# EAGLE design microsd-switch (EAGLE 6.5.0)
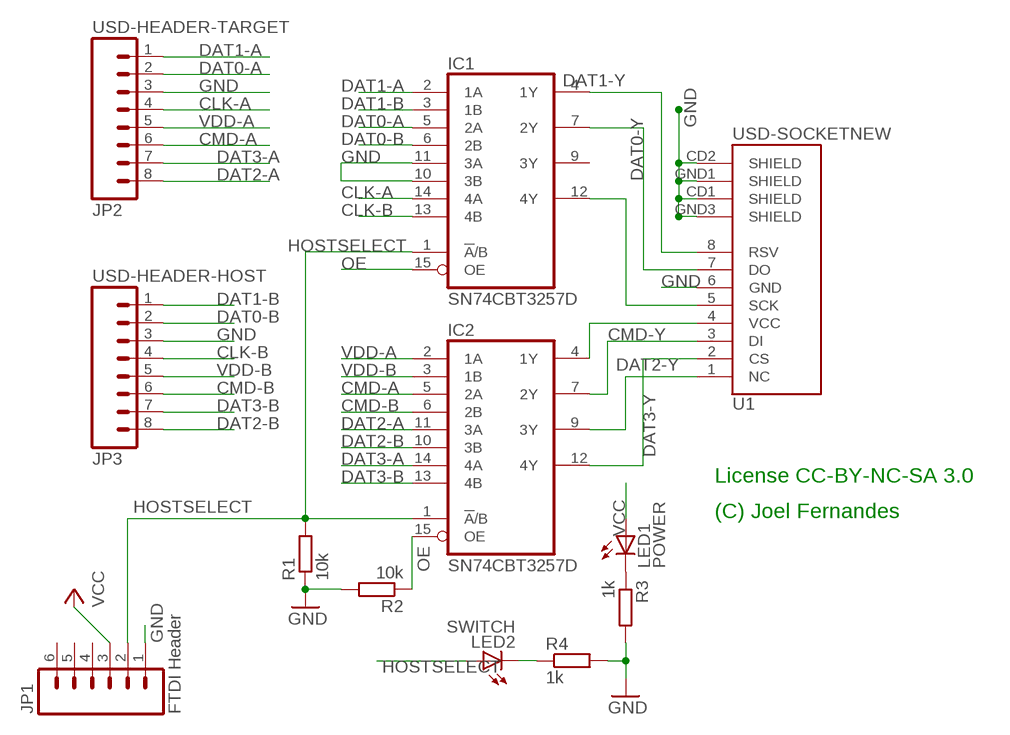
[diagram p0: schematic, sheet 1]

## Parts
IC1  SN74CBT3257D  [SO16]
IC2  SN74CBT3257D  [SO16]
JP1  FTDI Header  M06LOCK  [1X06_LOCK]
JP2  USD-HEADER-TARGET  M08LOCK  [1X08_LOCK]
JP3  USD-HEADER-HOST  M08LOCK  [1X08_LOCK]
LED1  POWER  LEDCHIP-LED0805  [CHIP-LED0805]
LED2  SWITCH  LEDCHIP-LED0805  [CHIP-LED0805]
R1  10k  R-EU_R1206  [R1206]
R2  10k  R-EU_R1206  [R1206]
R3  1k  R-EU_R1206  [R1206]
R4  1k  R-EU_R1206  [R1206]
U1  USD-SOCKETNEW  [MICRO-SD-SOCKET-PP]

## Nets
CLK-A: IC1.14(4A) JP2.4
CLK-B: IC1.13(4B) JP3.4
CLK-Y: IC1.12(4Y) U1.5(SCK)
CMD-A: IC2.5(2A) JP2.6
CMD-B: IC2.6(2B) JP3.6
CMD-Y: IC2.7(2Y) U1.3(DI)
DAT0-A: IC1.5(2A) JP2.2
DAT0-B: IC1.6(2B) JP3.2
DAT0-Y: IC1.7(2Y) U1.7(DO)
DAT1-A: IC1.2(1A) JP2.1
DAT1-B: IC1.3(1B) JP3.1
DAT1-Y: IC1.4(1Y) U1.8(RSV)
DAT2-A: IC2.11(3A) JP2.8
DAT2-B: IC2.10(3B) JP3.8
DAT2-Y: IC2.9(3Y) U1.1(NC)
DAT3-A: IC2.14(4A) JP2.7
DAT3-B: IC2.13(4B) JP3.7
DAT3-Y: IC2.12(4Y) U1.2(CS)
GND: IC1.10(3B) IC1.11(3A) JP1.1 JP2.3 JP3.3 R1.1 R2.2 R3.2 R4.2 U1.6(GND) U1.CD1(SHIELD) U1.CD2(SHIELD) U1.GND1(SHIELD) U1.GND3(SHIELD)
HOSTSELECT: IC1.1(!A!/B) IC2.1(!A!/B) JP1.2 LED2.A R1.2
N$2: IC2.4(1Y) U1.4(VCC)
N$3: LED1.C R3.1
N$4: LED2.C R4.1
OE: IC1.15(OE) IC2.15(OE) R2.1
VCC: JP1.3 LED1.A
VDD-A: IC2.2(1A) JP2.5
VDD-B: IC2.3(1B) JP3.5
Unconnected: IC1.9(3Y) JP1.4 JP1.5 JP1.6

## Notes on the sheet
- License CC-BY-NC-SA 3.0
- (C) Joel Fernandes

## Power pins joined to a net without a drawn wire
GND: IC1.8(GND) IC2.8(GND)
VCC: IC1.16(VCC) IC2.16(VCC)

## Library data of the parts
IC1 IC2 = joels-parts:SN74CBT3257: High speed Quad 1:2 MUX/DEMUX (4-5.5v vcc, 100mA channel)
JP1 = SparkFun:M06: Header 6 Standard 6-pin 0.1" header. Use with straight break away headers (SKU : PRT-00116), right angle break away headers (PRT-00553), swiss pins (PRT-00743), machine pins (PRT-00117), and female headers (PRT-00115). Molex polarized connector foot print use with SKU : PRT-08094 with associated crimp pins and housings. NOTES ON THE VARIANTS LOCK and LOCK_LONGPADS... This footprint was designed to help hold the alignment of a through-hole component (i.e. 6-pin header) while soldering it into place. You may notice that each hole has been shifted either up or down by 0.005 of an inch from it's more standard position (which is a perfectly straight line). This slight alteration caused the pins (the squares in the middle) to touch the edges of the holes. Because they are alternating, it causes a "brace" to hold the component in place. 0.005 has proven to be the perfect amount of "off-center" position when using our standard breakaway headers. Although looks a little odd when you look at the bare footprint, once you have a header in there, the alteration is very hard to notice. Also, if you push a header all the way into place, it is covered up entirely on the bottom side. This idea of altering the position of holes to aid alignment will be further integrated into the Sparkfun Library for other footprints. It can help hold any component with 3 or more connection pins.
JP2 JP3 = SparkFun:M08: Header 8 Standard 8-pin 0.1" header. Use with straight break away headers (SKU : PRT-00116), right angle break away headers (PRT-00553), swiss pins (PRT-00743), machine pins (PRT-00117), and female headers (PRT-00115).
LED1 LED2 = led:LED: LED OSRAM: - CHIPLED LG R971, LG N971, LY N971, LG Q971, LY Q971, LO R971, LY R971 LH N974, LH R974 LS Q976, LO Q976, LY Q976 LO Q996 - Hyper CHIPLED LW Q18S LB Q993, LB Q99A, LB R99A - SideLED LS A670, LO A670, LY A670, LG A670, LP A670 LB A673, LV A673, LT A673, LW A673 LH A674 LY A675 LS A676, LA A676, LO A676, LY A676, LW A676 LS A679, LY A679, LG A679 - Hyper Micro SIDELED® LS Y876, LA Y876, LO Y876, LY Y876 LT Y87S - SmartLED LW L88C, LW L88S LB L89C, LB L89S, LG L890 LS L89K, LO L89K, LY L89K LS L896, LA L896, LO L896, LY L896 - TOPLED LS T670, LO T670, LY T670, LG T670, LP T670 LSG T670, LSP T670, LSY T670, LOP T670, LYG T670 LG T671, LOG T671, LSG T671 LB T673, LV T673, LT T673, LW T673 LH T674 LS T676, LA T676, LO T676, LY T676, LB T676, LH T676, LSB T676, LW T676 LB T67C, LV T67C, LT T67C, LS T67K, LO T67K, LY T67K, LW E67C LS E67B, LA E67B, LO E67B, LY E67B, LB E67C, LV E67C, LT E67C LW T67C LS T679, LY T679, LG T679 LS T770, LO T770, LY T770, LG T770, LP T770 LB T773, LV T773, LT T773, LW T773 LH T774 LS E675, LA E675, LY E675, LS T675 LS T776, LA T776, LO T776, LY T776, LB T776 LHGB T686 LT T68C, LB T68C - Hyper Mini TOPLED® LB M676 - Mini TOPLED Santana® LG M470 LS M47K, LO M47K, LY M47K Source: http://www.osram.convergy.de LUXEON: - LUMILED® LXK2-PW12-R00, LXK2-PW12-S00, LXK2-PW14-U00, LXK2-PW14-V00 LXK2-PM12-R00, LXK2-PM12-S00, LXK2-PM14-U00 LXK2-PE12-Q00, LXK2-PE12-R00, LXK2-PE12-S00, LXK2-PE14-T00, LXK2-PE14-U00 LXK2-PB12-K00, LXK2-PB12-L00, LXK2-PB12-M00, LXK2-PB14-N00, LXK2-PB14-P00, LXK2-PB14-Q00 LXK2-PR12-L00, LXK2-PR12-M00, LXK2-PR14-Q00, LXK2-PR14-R00 LXK2-PD12-Q00, LXK2-PD12-R00, LXK2-PD12-S00 LXK2-PH12-R00, LXK2-PH12-S00 LXK2-PL12-P00, LXK2-PL12-Q00, LXK2-PL12-R00 Source: www.luxeon.com KINGBRIGHT: KA-3528ASYC Source: www.kingbright.com
R1-R4 = rcl:R-EU_: RESISTOR, European symbol
U1 = SparkFun:USD-SOCKET: microSD Socket Push-push type uSD socket. Schematic element and footprint production proven. Spark Fun Electronics SKU : PRT-00127. tDoc lines correctly indicate media card edge positions when inserting (unlocked, locked, depressed).

## Board
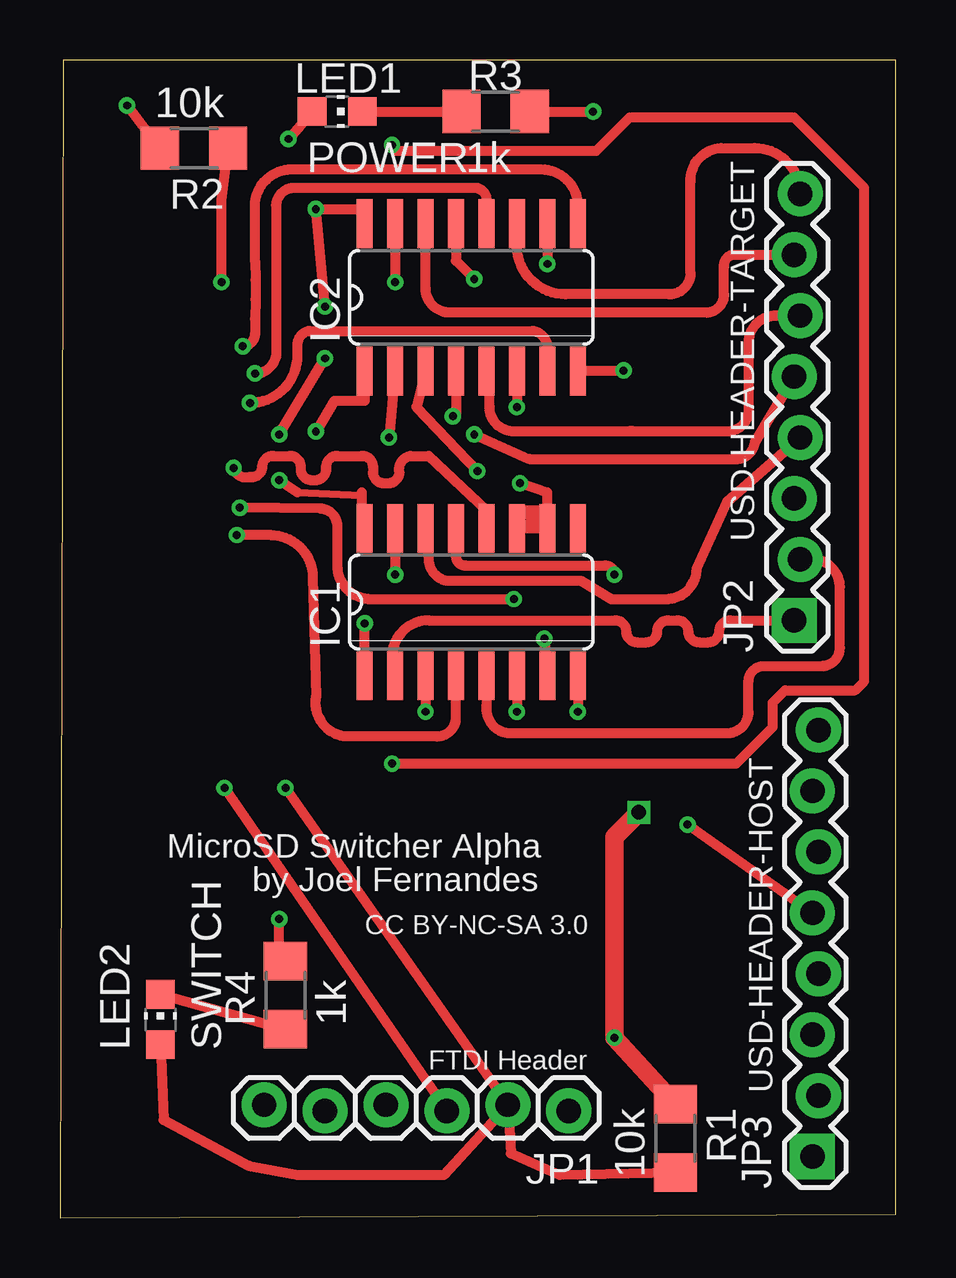
[diagram p1: board, top side]
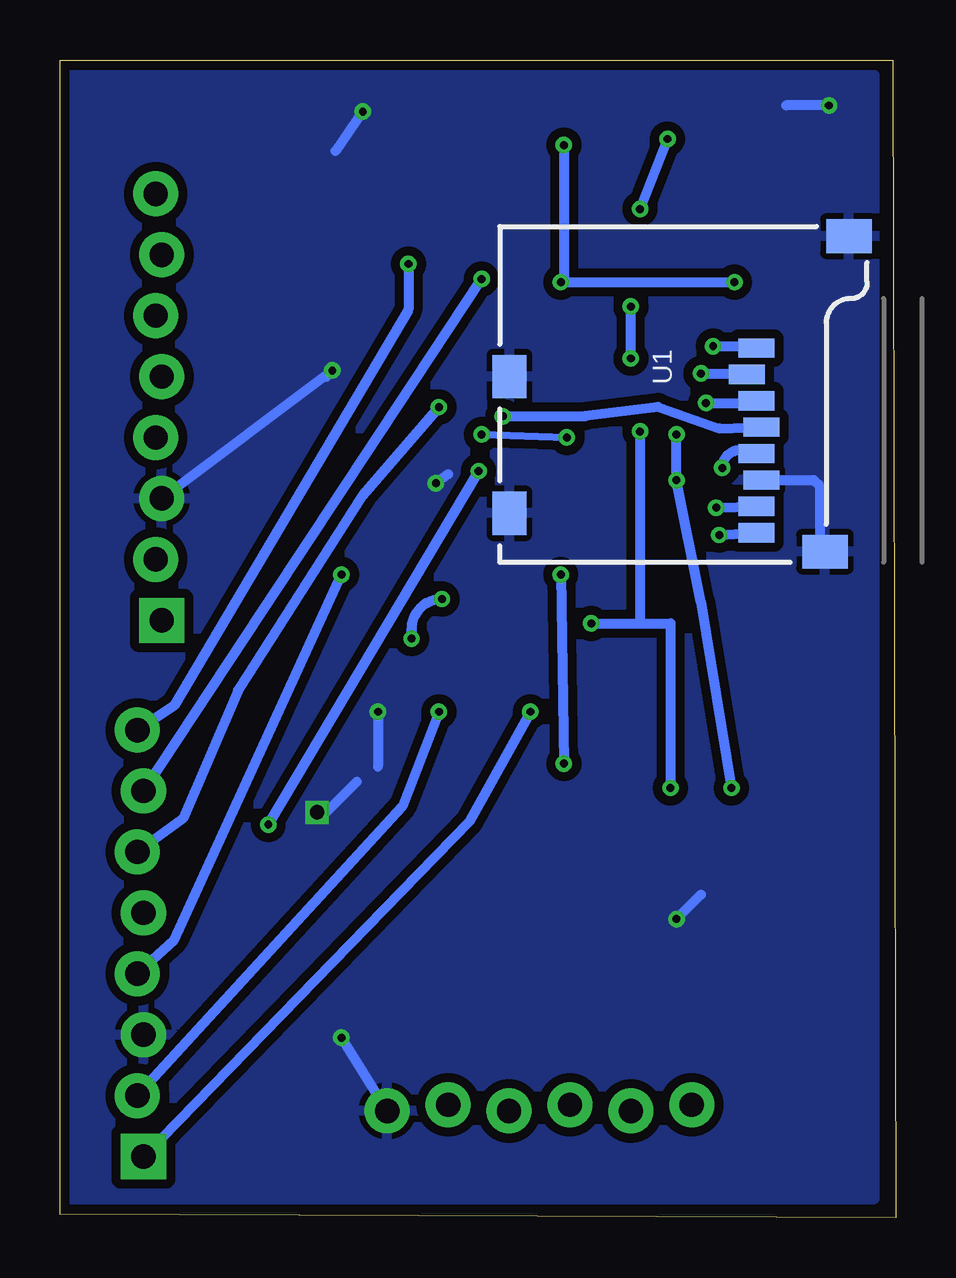
[diagram p2: board, bottom side, seen from below]

Size 34.85 x 48.25 mm. Coordinates in mm from the lower left corner, seen from the top.
Outline: 0,0 34.85,0.13 34.85,48.25 0.13,48.25 0,0
Copper layers (1*16): Top 0.0356mm / dielectric 1.5011mm / Bottom 0.0356mm
Design rules "LaenPCBOrder": minimum track width 6mil, minimum drill 13mil, track to track 6mil, track to pad 6mil, pad to pad 6mil, via to via 6mil, smd to smd 6mil, copper to edge 15mil, drill to drill 6mil, minimum pad ring 7mil, minimum via ring 7mil, stop-mask expansion 3mil, vias tented up to drill 0mil, thermal gap 10mil

### Footprints (pad centres in the part's own frame; a part is rotated, then mirrored left to right if it is on the bottom)
SO16 = smd 0.66 x 2.032: 1 -4.445,-3.073; 2 -3.175,-3.073; 3 -1.905,-3.073; 4 -0.635,-3.073; 5 0.635,-3.073; 6 1.905,-3.073; 7 3.175,-3.073; 8 4.445,-3.073; 9 4.445,3.073; 10 3.175,3.073; 11 1.905,3.073; 12 0.635,3.073; 13 -0.635,3.073; 14 -1.905,3.073; 15 -3.175,3.073; 16 -4.445,3.073
1X06_LOCK = drill 1.016 pad 1.88: 1 0,0; 2 2.54,-0.254; 3 5.08,0; 4 7.62,-0.254; 5 10.16,0; 6 12.7,-0.254
1X08_LOCK = drill 1.016 pad 1.88 square: 1 0,0.127 | drill 1.016 pad 1.88: 2 2.54,-0.127; 3 5.08,0.127; 4 7.62,-0.127; 5 10.16,0.127; 6 12.7,-0.127; 7 15.24,0.127; 8 17.78,-0.127
CHIP-LED0805 = smd 1.2 x 1.2: A 0,-1.05; C 0,1.05
R1206 = smd 1.6 x 1.803: 1 -1.422,0; 2 1.422,0
MICRO-SD-SOCKET-PP = smd 0.8 x 1.5: 1 -8.94,10.7; 2 -7.84,10.3; 3 -6.74,10.7; 4 -5.64,10.9; 5 -4.54,10.7; 6 -3.44,10.9; 7 -2.34,10.7; 8 -1.24,10.7 | smd 1.8 x 1.4: CD1 -2.05,0.4; CD2 -7.75,0.4 | smd 1.4 x 1.9: GND1 -13.6,14.55; GND3 -0.45,13.55

### Placement (x,y rotation side)
IC1  17.14,25.65 0 top
IC2  17.14,38.35 0 top
JP1  21.21,4.45 180 top
JP2  30.73,24.89 90 top
JP3  31.5,2.54 90 top
LED1  11.56,46.1 270 top
LED2  4.19,8.25 0 top
R1  25.65,3.3 270 top
R2  5.59,44.58 180 top
R3  18.16,46.1 0 top
R4  9.4,9.27 90 top
U1  16.51,27.31 270 bottom

### Tracks (layer width: path | path; a pad name or v marks a point on that pad's centre or on a via)
CLK-A
  Top 0.406: IC1.14 15.37,27.43 arc79 16.13,26.54 21.72,26.54 22.99,25.78 25.27,25.78 arc90 26.54,27.05 27.81,29.85 JP2.4
CLK-B  (via drill 0.33)
  Top 0.406: IC1.13 16.51,27.56 arc90 16.89,27.18 22.73,27.18 arc-90 v23.11,26.8
  Bottom 0.406: v23.11,26.8 30.1,11.56 JP3.4
CLK-Y  (via drill 0.33)
  Top 0.406: v7.24,31.24 arc90 7.87,30.86 8,30.86 arc90 8.43,31.29 arc-90 8.89,31.75 9.58,31.75 arc-90 10.04,31.29 10.04,31.19 arc90 10.49,30.73 10.64,30.73 arc90 11.1,31.19 11.1,31.29 arc-90 11.56,31.75 12.59,31.75 arc-90 13.05,31.29 13.05,31.06 arc90 13.5,30.61 13.69,30.61 arc90 14.15,31.06 14.15,31.04 arc-90 14.6,31.75 15.37,31.75 17.78,29.46 IC1.12
  Bottom 0.406: v7.24,31.24 arc122 6.1,31.88 6.06,31.85 U1.5
CMD-A
  Top 0.406: 23.75,32.77 arc-90 23.88,32.77 | 23.88,32.77 23.75,32.77 | 23.75,32.77 18.92,32.77 arc-90 17.91,33.78 17.91,35.15 IC2.5 | JP2.6 29.84,37.59 arc90 28.7,36.45 28.7,33.66 arc-90 27.81,32.77 23.88,32.77
CMD-B  (via drill 0.33)
  Top 0.406: IC2.6 v19.05,33.78
  Bottom 0.406: v19.05,33.78 22.23,30.1 27.43,21.97 29.72,16.64 JP3.6
CMD-Y  (via drill 0.33)
  Top 0.406: v7.92,33.96 arc90 9.91,35.94 9.91,36.32 arc-90 10.41,36.96 19.69,36.96 arc-90 20.32,36.2 IC2.7
  Bottom 0.406: v7.92,33.96 5.9,33.96 arc-90 U1.3
DAT0-A
  Top 0.406: IC1.5 17.78,21.34 arc90 18.67,20.19 27.81,20.19 arc90 28.7,21.08 28.7,22.35 arc-90 29.34,22.99 31.75,22.99 arc90 32.51,23.75 32.51,26.29 arc90 31.37,27.43 JP2.2
DAT0-B  (via drill 0.33)
  Top 0.406: IC1.6 v19.05,21.08
  Bottom 0.406: JP3.2 20.57,17.14 v19.05,21.08
DAT0-Y  (via drill 0.33)
  Top 0.406: v18.92,25.78 12.95,25.78 arc-90 11.56,27.18 11.56,28.83 arc90 10.83,29.56 v7.49,29.59 | v20.19,24.13 arc-11 20.19,23.24 20.32,23.11 IC1.7
  Bottom 0.406: v18.92,25.78 arc-95 20.19,24.38 arc11 v20.19,24.13 | v7.49,29.59 U1.7
DAT1-A
  Top 0.406: JP2.1 27.94,24.89 arc90 27.48,24.43 arc-90 27.03,23.98 26.65,23.98 arc-90 26.19,24.43 arc90 25.73,24.89 25.35,24.89 arc90 24.9,24.43 arc-90 24.44,23.98 24.06,23.98 arc-90 23.6,24.43 arc90 23.15,24.89 15.37,24.89 arc90 13.84,23.37 13.84,22.71 IC1.2
DAT1-B  (via drill 0.33)
  Top 0.406: IC1.3 v15.24,21.08
  Bottom 0.406: v15.24,21.08 17.78,16.51 JP3.1
DAT1-Y  (via drill 0.33)
  Top 0.406: IC1.4 16.51,20.83 arc-98 15.62,20.07 11.81,20.07 arc-90 10.67,21.72 10.54,26.67 arc90 8.76,28.45 v7.37,28.45
  Bottom 0.406: v7.37,28.45 U1.8
DAT2-A
  Top 0.406: JP2.8 arc90 28.96,44.58 27.56,44.58 arc90 26.29,43.18 26.29,39.37 arc-90 25.4,38.48 21.08,38.48 arc-93 19.05,40.64 IC2.11
DAT2-B  (via drill 0.33)
  Top 0.406: IC2.10 v20.32,39.75
  Bottom 0.406: v20.32,39.75 20.32,37.85 30.1,21.34 JP3.8
DAT2-Y  (via drill 0.33)
  Top 0.406: v7.62,36.32 arc90 8.13,36.83 8.13,37.47 arc4 8.13,39.88 8.13,42.16 arc-90 9.65,43.69 20.07,43.69 arc-90 21.59,42.16 IC2.9
  Bottom 0.406: v7.62,36.32 5.89,36.32 arc90 U1.1
DAT3-A
  Top 0.406: IC2.14 15.24,38.73 arc90 16.26,37.72 26.92,37.72 arc90 27.69,38.48 27.69,39.62 arc-90 28.07,40.13 JP2.7
DAT3-B  (via drill 0.33)
  Top 0.406: IC2.13 16.51,39.88 v17.27,39.12
  Bottom 0.406: v17.27,39.12 JP3.7
DAT3-Y  (via drill 0.33)
  Top 0.406: v8.13,35.18 arc90 9.02,36.07 9.02,42.16 arc-90 9.78,42.93 17.27,42.93 arc-90 17.78,42.42 IC2.12
  Bottom 0.406: v8.13,35.18 6.24,35.18 arc90 U1.2
GND  (via drill 0.33, 0.6)
  Top 0.406: 19.05,29.46 20.32,29.46 20.19,29.34 19.05,29.34 20.07,29.21 20.19,29.21 IC1.11 IC1.10 20.32,30.23 v19.18,30.61 | IC2.8 21.59,35.31 v23.49,35.31 | R3.2 v22.23,46.1 | IC1.8 v21.59,21.08 | R2.2 v2.79,46.36 | R4.2 9.14,10.69 v9.14,12.45
  Top 0.762: R1.1 v23.11,7.49 23.11,15.88 v24.13,16.89
  Bottom 0.406: v19.18,30.61 18.67,30.99 | v22.23,46.1 23.37,44.45 | v21.59,21.08 21.59,18.8 | v2.79,46.36 4.57,46.36 | v9.14,12.45 8.13,13.46 | U1.6 3.44,30.75 3.17,30.48 3.17,27.97 U1.GND3 | 23.75,35.05 v23.49,35.31 JP2.3 | v24.13,16.89 23.75,16.89 22.48,18.16 | JP1.1 v23.11,7.49
  pour Bottom (isolate 0.381): 0.89,47.62 34.42,47.62 34.42,45.72 34.42,0.76 0.89,0.76
HOSTSELECT  (via drill 0.33)
  Top 0.406: IC1.1 v12.7,24.77 | IC2.1 12.7,34.04 11.43,34.04 v10.67,32.77 | LED2.A 4.32,4.06 7.87,2.16 9.91,1.78 16,1.78 JP1.2 | v9.4,17.91 JP1.2 | JP1.2 18.8,2.67 20.83,1.78 R1.2
  Bottom 0.406: v12.7,24.77 10.67,24.77 | 10.67,24.77 9.4,24.77 v9.4,17.91 | v10.67,32.77 10.67,24.77
N$2  (via drill 0.33)
  Top 0.406: IC2.4 16.51,33.66 arc-90 v16.38,33.4
  Bottom 0.406: v16.38,33.4 12.95,33.4 9.91,33.78 7.37,32.89 U1.4
N$3
  Top 0.406: LED1.C R3.1
N$4
  Top 0.406: LED2.C R4.1
OE  (via drill 0.33)
  Top 0.406: IC2.15 v13.97,38.99 | v6.73,38.99 6.73,42.42 R2.1 | IC1.15 v13.97,26.8 | v13.84,18.92 28.19,18.92 29.72,20.45 29.72,21.46 30.23,21.97 33.15,21.97 33.53,22.35 33.53,42.93 30.61,45.85 23.75,45.85 22.35,44.45 13.97,44.45 v13.84,44.7
  Bottom 0.406: v6.73,38.99 v13.97,38.99 13.84,39.12 v13.84,44.7 | v13.97,26.8 v13.84,18.92
VCC  (via drill 0.33)
  Top 0.305: 9.91,30.23 12.57,30.1
  Top 0.406: LED1.A v9.52,44.96 | 12.57,30.23 12.57,30.1 12.57,28.85 IC1.16 | v9.14,32.64 v11.05,35.81 | v11.05,37.97 v10.67,42.04 12.7,42.04 IC2.16 | v6.86,17.91 JP1.3 | v9.14,30.73 9.91,30.23
  Bottom 0.406: v9.52,44.96 v10.67,42.04 | v9.14,32.64 v9.14,30.73 8.13,25.65 v6.86,17.91 | v11.05,35.81 v11.05,37.97
VDD-A  (via drill 0.33)
  Top 0.406: IC2.2 v13.72,32.51 | v17.27,32.64 19.56,31.62 28.07,31.62 arc90 28.96,32.26 JP2.5
  Bottom 0.305: v13.72,32.51 v17.27,32.64
VDD-B  (via drill 0.33)
  Top 0.406: IC2.3 14.86,33.78 v17.4,31.11 | v26.16,16.38 JP3.5
  Bottom 0.406: v17.4,31.11 v26.16,16.38

### Text on the board
tNames: MicroSD Switcher Alpha | by Joel Fernandes | CC BY-NC-SA 3.0